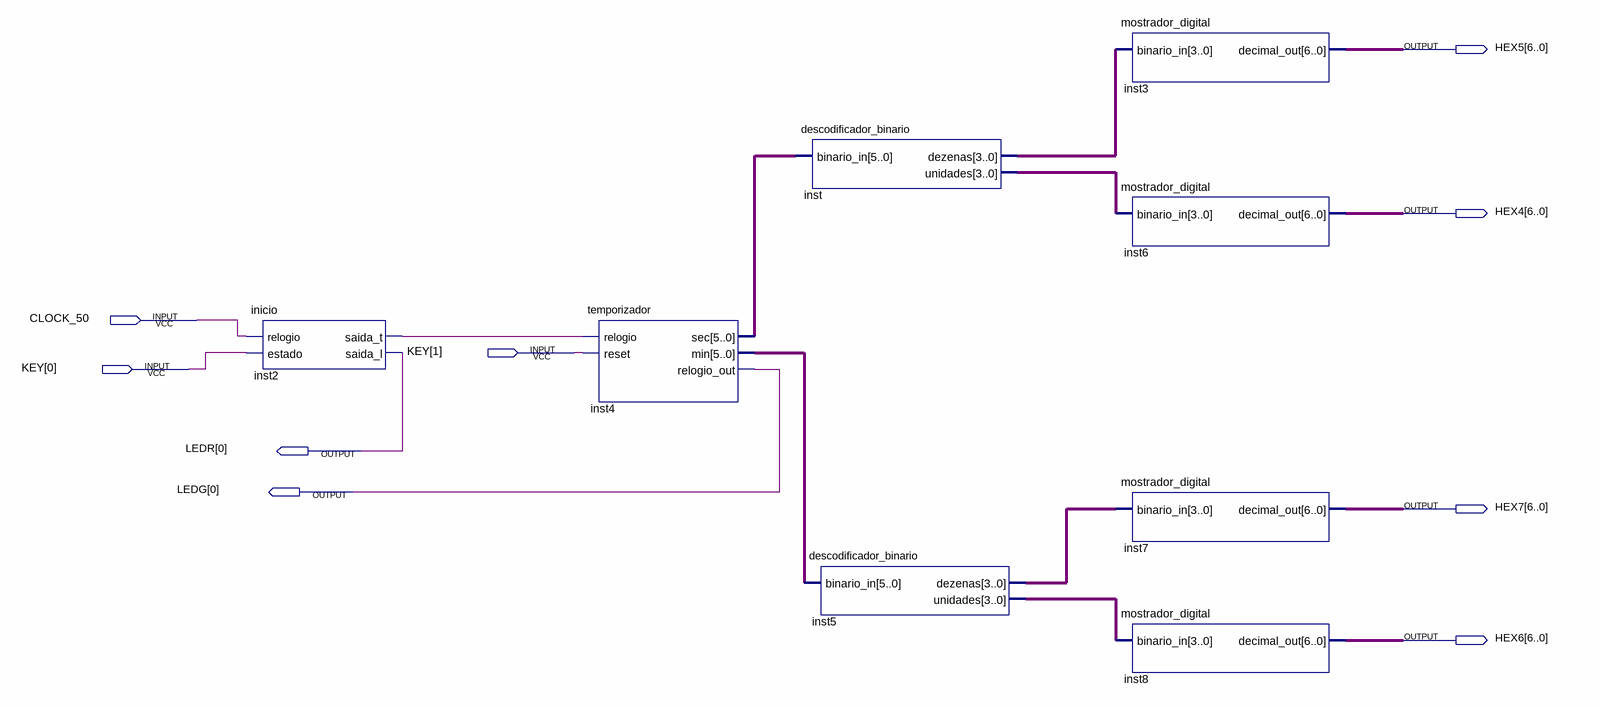
[diagram p0: schematic sheet]
// Quartus schematic esquematico.bdf as structural Verilog: 8 symbols, 9 pins
module esquematico (
  input  CLOCK_50,
  input  [1:0] KEY,
  output [6:0] HEX5,
  output [6:0] HEX4,
  output [0:0] LEDR,
  output [0:0] LEDG,
  output [6:0] HEX7,
  output [6:0] HEX6
);

  wire inst2_saida_t;
  wire [3:0] inst5_dezenas, inst5_unidades, inst_dezenas, inst_unidades;
  wire [5:0] inst4_min, inst4_sec;

  inicio inst2 (.relogio(CLOCK_50), .estado(KEY[0]), .saida_t(inst2_saida_t), .saida_l(LEDR[0]));
  temporizador inst4 (.relogio(inst2_saida_t), .reset(KEY[1]), .sec(inst4_sec), .min(inst4_min), .relogio_out(LEDG[0]));
  descodificador_binario inst (.binario_in(inst4_sec), .dezenas(inst_dezenas), .unidades(inst_unidades));
  descodificador_binario inst5 (.binario_in(inst4_min), .dezenas(inst5_dezenas), .unidades(inst5_unidades));
  mostrador_digital inst3 (.binario_in(inst_dezenas), .decimal_out(HEX5));
  mostrador_digital inst6 (.binario_in(inst_unidades), .decimal_out(HEX4));
  mostrador_digital inst7 (.binario_in(inst5_dezenas), .decimal_out(HEX7));
  mostrador_digital inst8 (.binario_in(inst5_unidades), .decimal_out(HEX6));
endmodule
